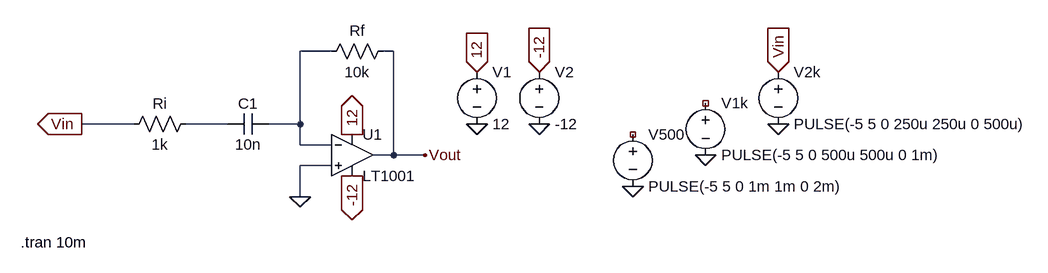
[diagram p0: schematic lab8.3.1.asc]
lab8.3.1.asc, the LTspice schematic file:
Version 4
SHEET 1 1224 680
WIRE 128 -16 80 -16
WIRE 224 -16 208 -16
WIRE -176 96 -256 96
WIRE -32 96 -96 96
WIRE 80 96 80 -16
WIRE 80 96 32 96
WIRE 80 128 80 96
WIRE 128 128 80 128
WIRE 224 144 224 -16
WIRE 224 144 192 144
WIRE 272 144 224 144
WIRE 128 160 80 160
WIRE 80 208 80 160
FLAG 352 96 0
FLAG 448 96 0
FLAG 352 16 12
IOPIN 352 16 In
FLAG 160 112 12
IOPIN 160 112 Out
FLAG 448 16 -12
IOPIN 448 16 In
FLAG 160 176 -12
IOPIN 160 176 Out
FLAG 816 16 Vin
IOPIN 816 16 In
FLAG -256 96 Vin
IOPIN -256 96 Out
FLAG 272 144 Vout
FLAG 80 208 0
FLAG 592 192 0
FLAG 704 144 0
FLAG 816 96 0
SYMBOL voltage 352 0 R0
SYMATTR InstName V1
SYMATTR Value 12
SYMBOL voltage 448 0 R0
SYMATTR InstName V2
SYMATTR Value -12
SYMBOL res 224 -32 R90
WINDOW 0 0 56 VBottom 2
WINDOW 3 32 56 VTop 2
SYMATTR InstName Rf
SYMATTR Value 10k
SYMBOL cap 32 80 R90
WINDOW 0 0 32 VBottom 2
WINDOW 3 32 32 VTop 2
SYMATTR InstName C1
SYMATTR Value 10n
SYMBOL voltage 592 96 R0
WINDOW 123 0 0 Left 0
WINDOW 39 0 0 Left 0
SYMATTR InstName V500
SYMATTR Value PULSE(-5 5 0 1m 1m 0 2m)
SYMBOL Opamps\\LT1001 160 80 R0
SYMATTR InstName U1
SYMBOL res -80 80 R90
WINDOW 0 0 56 VBottom 2
WINDOW 3 32 56 VTop 2
SYMATTR InstName Ri
SYMATTR Value 1k
SYMBOL voltage 704 48 R0
WINDOW 123 0 0 Left 0
WINDOW 39 0 0 Left 0
SYMATTR InstName V1k
SYMATTR Value PULSE(-5 5 0 500u 500u 0 1m)
SYMBOL voltage 816 0 R0
WINDOW 123 0 0 Left 0
WINDOW 39 0 0 Left 0
SYMATTR InstName V2k
SYMATTR Value PULSE(-5 5 0 250u 250u 0 500u)
TEXT -350 278 Left 2 !.tran 10m

The netlist it stands for:
* lab8.3.1.asc
V1 12 0 12
V2 -12 0 -12
Rf Vout N001 10k
C1 N001 N002 10n
V500 NC_01 0 PULSE(-5 5 0 1m 1m 0 2m)
XU1 0 N001 12 -12 Vout LT1001  ; pins In+ In- V+ V- OUT
Ri N002 Vin 1k
V1k NC_02 0 PULSE(-5 5 0 500u 500u 0 1m)
V2k Vin 0 PULSE(-5 5 0 250u 250u 0 500u)
.tran 10m
.lib LTC.lib
.backanno
.end